# EAGLE design Lm7704 (EAGLE 9.1.3)
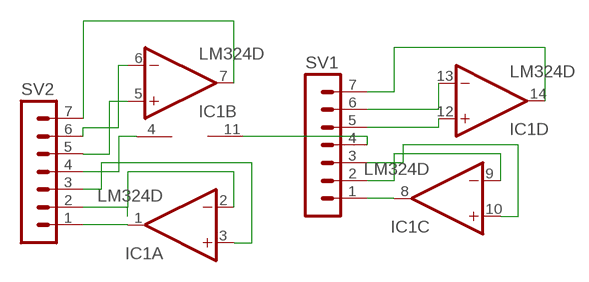
[diagram p0: schematic, sheet 1]

## Parts
IC1  LM324D  [SO14]
SV1  MA07-1  [MA07-1]
SV2  MA07-1  [MA07-1]

## Nets
N$1: IC1.1(A:OUT) SV2.1
N$2: IC1.2(A:-IN) SV2.2
N$3: IC1.3(A:+IN) SV2.3
N$4: IC1.4(P:V+) SV2.4
N$5: IC1.5(B:+IN) SV2.5
N$6: IC1.6(B:-IN) SV2.6
N$7: IC1.7(B:OUT) SV2.7
N$8: IC1.8(C:OUT) SV1.1
N$9: IC1.9(C:-IN) SV1.2
N$10: IC1.10(C:+IN) SV1.3
N$11: IC1.11(P:V-) SV1.4
N$12: IC1.12(D:+IN) SV1.5
N$13: IC1.13(D:-IN) SV1.6
N$14: IC1.14(D:OUT) SV1.7

## Library data of the parts
IC1 = linear:LM324: OP AMP
SV1 SV2 = con-lstb:MA07-1: PIN HEADER; OC_FARNELL: unknown; OC_NEWARK: unknown

## Board
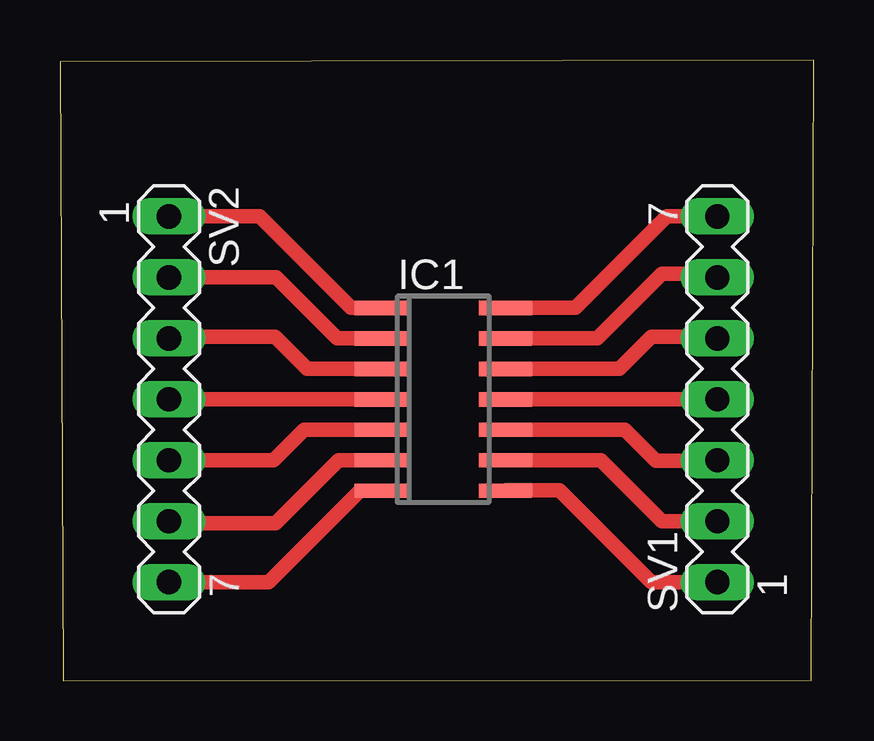
[diagram p1: board, top side]

Size 31.42 x 25.87 mm. Coordinates in mm from the lower left corner, seen from the top.
Outline: 0.13,0 31.32,0.03 31.42,25.87 0,25.8 0.13,0
Copper layers (1*16): Top 0.035mm / dielectric 1.5mm / Bottom 0.035mm
Design rules "default": minimum track width 6mil, minimum drill 0.35mm, track to track 6mil, track to pad 6mil, pad to pad 6mil, via to via 6mil, smd to smd 6mil, copper to edge 40mil, drill to drill 6mil, minimum pad ring 10mil, minimum via ring 8mil, stop-mask expansion 4mil, vias tented up to drill 0mil, thermal gap 10mil

### Footprints (pad centres in the part's own frame; a part is rotated, then mirrored left to right if it is on the bottom)
SO14 = smd 0.6 x 2.2: 1 -3.81,-2.6; 2 -2.54,-2.6; 3 -1.27,-2.6; 4 0,-2.6; 5 1.27,-2.6; 6 2.54,-2.6; 7 3.81,-2.6; 8 3.81,2.6; 9 2.54,2.6; 10 1.27,2.6; 11 0,2.6; 12 -1.27,2.6; 13 -2.54,2.6; 14 -3.81,2.6
MA07-1 = drill 1.016 long: 1 -7.62,0; 2 -5.08,0; 3 -2.54,0; 4 0,0; 5 2.54,0; 6 5.08,0; 7 7.62,0

### Placement (x,y rotation side)
IC1  15.98,11.73 270 top
SV1  27.41,11.73 90 top
SV2  4.55,11.73 270 top

### Tracks (layer width: path | path; a pad name or v marks a point on that pad's centre or on a via)
N$1
  Top 0.61: SV2.1 8.32,19.35 12.13,15.54 IC1.1
N$2
  Top 0.61: IC1.2 11.56,14.27 9.02,16.81 SV2.2
N$3
  Top 0.61: IC1.3 10.31,13 8.97,14.35 4.62,14.35 SV2.3
N$4
  Top 0.61: IC1.4 SV2.4
N$5
  Top 0.61: SV2.5 8.92,9.19 10.19,10.46 IC1.5
N$6
  Top 0.61: IC1.6 11.61,9.19 8.99,6.58 4.62,6.58 SV2.6
N$7
  Top 0.61: SV2.7 8.7,4.11 12.51,7.92 IC1.7
N$8
  Top 0.61: SV1.1 24.66,4.11 20.83,7.95 18.6,7.95 IC1.8
N$9
  Top 0.61: IC1.9 22.56,9.19 25.1,6.65 SV1.2
N$10
  Top 0.61: IC1.10 23.55,10.46 24.84,9.17 27.38,9.17 SV1.3
N$11
  Top 0.61: IC1.11 SV1.4
N$12
  Top 0.61: IC1.12 23.32,13 24.66,14.35 27.33,14.35 SV1.5
N$13
  Top 0.61: IC1.13 22.4,14.27 25.1,16.97 27.25,16.97 SV1.6
N$14
  Top 0.61: IC1.14 21.49,15.54 25.3,19.35 SV1.7